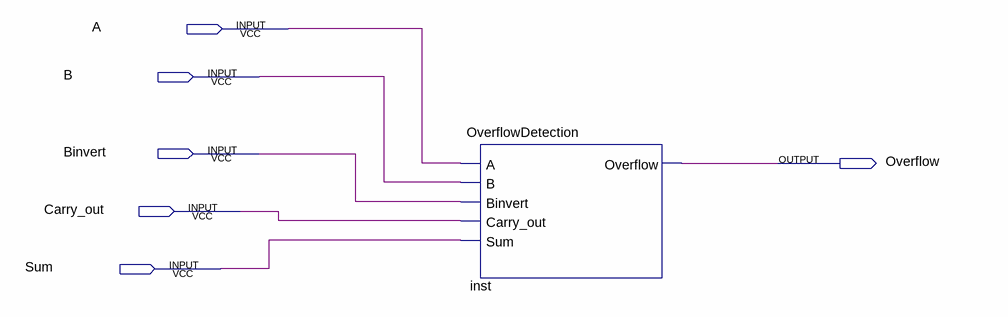
[diagram p0: schematic sheet]
// Quartus schematic TestOverflow.bdf as structural Verilog: 1 symbols, 6 pins
module TestOverflow (
  input  A,
  input  B,
  input  Binvert,
  input  Carry_out,
  input  Sum,
  output Overflow
);

  OverflowDetection inst (.A(A), .B(B), .Binvert(Binvert), .Carry_out(Carry_out), .Sum(Sum), .Overflow(Overflow));
endmodule
